# EAGLE design projekt (EAGLE 7.6.0)
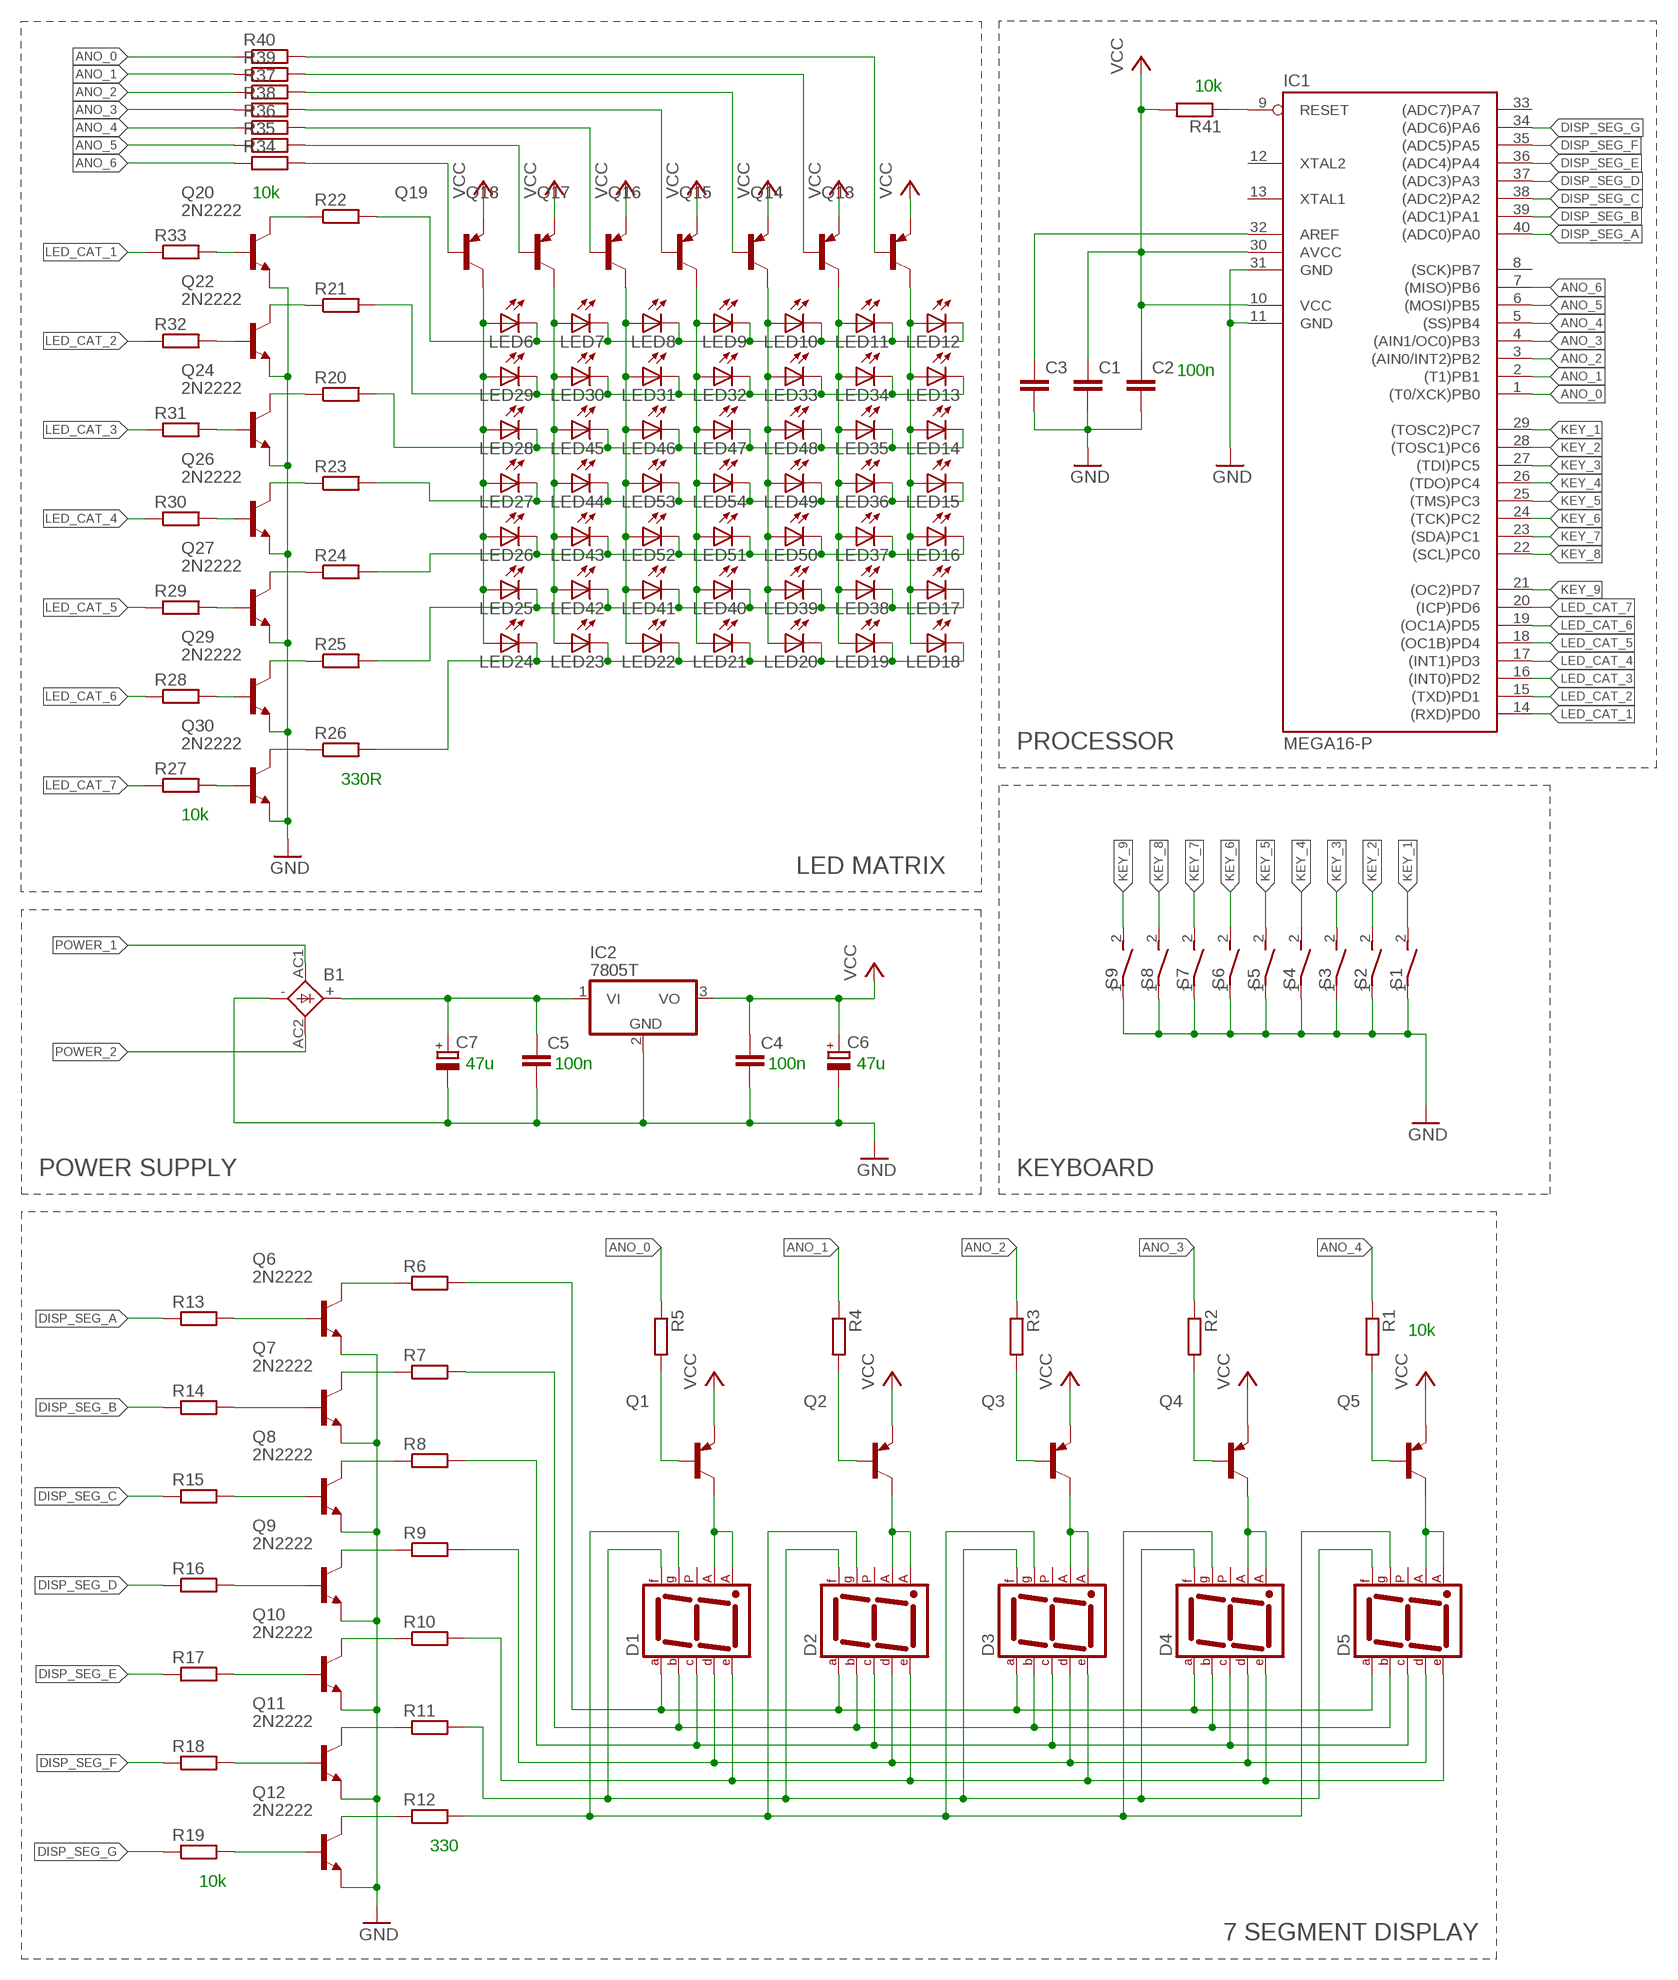
[diagram p0: schematic, sheet 1]

## Parts
B1  KBU  [KBU]
C1  C5/7.2  [C5B7.2]
C2  C5/7.2  [C5B7.2]
C3  C5/7.2  [C5B7.2]
C4  C5/7.2  [C5B7.2]
C5  C5/7.2  [C5B7.2]
C6  CPOL-EUB45181C  [B45181C]
C7  CPOL-EUB45181C  [B45181C]
D1  7SEG-CA  [7SEG-13]
D2  7SEG-CA  [7SEG-13]
D3  7SEG-CA  [7SEG-13]
D4  7SEG-CA  [7SEG-13]
D5  7SEG-CA  [7SEG-13]
IC1  MEGA16-P  [DIL40]
IC2  7805T  [TO220H]
LED6  LED3MM  [LED3MM]
LED7  LED3MM  [LED3MM]
LED8  LED3MM  [LED3MM]
LED9  LED3MM  [LED3MM]
LED10  LED3MM  [LED3MM]
LED11  LED3MM  [LED3MM]
LED12  LED3MM  [LED3MM]
LED13  LED3MM  [LED3MM]
LED14  LED3MM  [LED3MM]
LED15  LED3MM  [LED3MM]
LED16  LED3MM  [LED3MM]
LED17  LED3MM  [LED3MM]
LED18  LED3MM  [LED3MM]
LED19  LED3MM  [LED3MM]
LED20  LED3MM  [LED3MM]
LED21  LED3MM  [LED3MM]
LED22  LED3MM  [LED3MM]
LED23  LED3MM  [LED3MM]
LED24  LED3MM  [LED3MM]
LED25  LED3MM  [LED3MM]
LED26  LED3MM  [LED3MM]
LED27  LED3MM  [LED3MM]
LED28  LED3MM  [LED3MM]
LED29  LED3MM  [LED3MM]
LED30  LED3MM  [LED3MM]
LED31  LED3MM  [LED3MM]
LED32  LED3MM  [LED3MM]
LED33  LED3MM  [LED3MM]
LED34  LED3MM  [LED3MM]
LED35  LED3MM  [LED3MM]
LED36  LED3MM  [LED3MM]
LED37  LED3MM  [LED3MM]
LED38  LED3MM  [LED3MM]
LED39  LED3MM  [LED3MM]
LED40  LED3MM  [LED3MM]
LED41  LED3MM  [LED3MM]
LED42  LED3MM  [LED3MM]
LED43  LED3MM  [LED3MM]
LED44  LED3MM  [LED3MM]
LED45  LED3MM  [LED3MM]
LED46  LED3MM  [LED3MM]
LED47  LED3MM  [LED3MM]
LED48  LED3MM  [LED3MM]
LED49  LED3MM  [LED3MM]
LED50  LED3MM  [LED3MM]
LED51  LED3MM  [LED3MM]
LED52  LED3MM  [LED3MM]
LED53  LED3MM  [LED3MM]
LED54  LED3MM  [LED3MM]
Q1  -PNP-TO18-  [TO18-]
Q2  -PNP-TO18-  [TO18-]
Q3  -PNP-TO18-  [TO18-]
Q4  -PNP-TO18-  [TO18-]
Q5  -PNP-TO18-  [TO18-]
Q6  2N2222  [TO18]
Q7  2N2222  [TO18]
Q8  2N2222  [TO18]
Q9  2N2222  [TO18]
Q10  2N2222  [TO18]
Q11  2N2222  [TO18]
Q12  2N2222  [TO18]
Q13  -PNP-TO18-  [TO18-]
Q14  -PNP-TO18-  [TO18-]
Q15  -PNP-TO18-  [TO18-]
Q16  -PNP-TO18-  [TO18-]
Q17  -PNP-TO18-  [TO18-]
Q18  -PNP-TO18-  [TO18-]
Q19  -PNP-TO18-  [TO18-]
Q20  2N2222  [TO18]
Q22  2N2222  [TO18]
Q24  2N2222  [TO18]
Q26  2N2222  [TO18]
Q27  2N2222  [TO18]
Q29  2N2222  [TO18]
Q30  2N2222  [TO18]
R1  R-EU_0204/5  [0204/5]
R2  R-EU_0204/5  [0204/5]
R3  R-EU_0204/5  [0204/5]
R4  R-EU_0204/5  [0204/5]
R5  R-EU_0204/5  [0204/5]
R6  R-EU_0204/5  [0204/5]
R7  R-EU_0204/5  [0204/5]
R8  R-EU_0204/5  [0204/5]
R9  R-EU_0204/5  [0204/5]
R10  R-EU_0204/5  [0204/5]
R11  R-EU_0204/5  [0204/5]
R12  R-EU_0204/5  [0204/5]
R13  R-EU_0204/5  [0204/5]
R14  R-EU_0204/5  [0204/5]
R15  R-EU_0204/5  [0204/5]
R16  R-EU_0204/5  [0204/5]
R17  R-EU_0204/5  [0204/5]
R18  R-EU_0204/5  [0204/5]
R19  R-EU_0204/5  [0204/5]
R20  R-EU_0204/5  [0204/5]
R21  R-EU_0204/5  [0204/5]
R22  R-EU_0204/5  [0204/5]
R23  R-EU_0204/5  [0204/5]
R24  R-EU_0204/5  [0204/5]
R25  R-EU_0204/5  [0204/5]
R26  R-EU_0204/5  [0204/5]
R27  R-EU_0204/5  [0204/5]
R28  R-EU_0204/5  [0204/5]
R29  R-EU_0204/5  [0204/5]
R30  R-EU_0204/5  [0204/5]
R31  R-EU_0204/5  [0204/5]
R32  R-EU_0204/5  [0204/5]
R33  R-EU_0204/5  [0204/5]
R34  R-EU_0204/5  [0204/5]
R35  R-EU_0204/5  [0204/5]
R36  R-EU_0204/5  [0204/5]
R37  R-EU_0204/5  [0204/5]
R38  R-EU_0204/5  [0204/5]
R39  R-EU_0204/5  [0204/5]
R40  R-EU_0204/5  [0204/5]
R41  R-EU_0204/5  [0204/5]
S1  DS01E  [DS-01]
S2  DS01E  [DS-01]
S3  DS01E  [DS-01]
S4  DS01E  [DS-01]
S5  DS01E  [DS-01]
S6  DS01E  [DS-01]
S7  DS01E  [DS-01]
S8  DS01E  [DS-01]
S9  DS01E  [DS-01]

## Nets
ANO_0: IC1.1((T0/XCK)PB0) R5.1 R40.1
ANO_1: IC1.2((T1)PB1) R4.1 R39.1
ANO_2: IC1.3((AIN0/INT2)PB2) R3.1 R37.1
ANO_3: IC1.4((AIN1/OC0)PB3) R2.1 R38.1
ANO_4: IC1.5((SS)PB4) R1.1 R36.1
ANO_5: IC1.6((MOSI)PB5) R35.1
ANO_6: IC1.7((MISO)PB6) R34.1
DISP_SEG_A: IC1.40((ADC0)PA0) R13.1
DISP_SEG_B: IC1.39((ADC1)PA1) R14.1
DISP_SEG_C: IC1.38((ADC2)PA2) R15.1
DISP_SEG_D: IC1.37((ADC3)PA3) R16.1
DISP_SEG_E: IC1.36((ADC4)PA4) R17.1
DISP_SEG_F: IC1.35((ADC5)PA5) R18.1
DISP_SEG_G: IC1.34((ADC6)PA6) R19.1
GND: B1.- C1.2 C2.2 C3.2 C4.2 C5.2 C6.- C7.- IC1.11(GND) IC1.31(GND) IC2.2(GND) Q6.1(E) Q7.1(E) Q8.1(E) Q9.1(E) Q10.1(E) Q11.1(E) Q12.1(E) Q20.1(E) Q22.1(E) Q24.1(E) Q26.1(E) Q27.1(E) Q29.1(E) Q30.1(E) S1.1 S2.1 S3.1 S4.1 S5.1 S6.1 S7.1 S8.1 S9.1
KEY_1: IC1.29((TOSC2)PC7) S1.2
KEY_2: IC1.28((TOSC1)PC6) S2.2
KEY_3: IC1.27((TDI)PC5) S3.2
KEY_4: IC1.26((TDO)PC4) S4.2
KEY_5: IC1.25((TMS)PC3) S5.2
KEY_6: IC1.24((TCK)PC2) S6.2
KEY_7: IC1.23((SDA)PC1) S7.2
KEY_8: IC1.22((SCL)PC0) S8.2
KEY_9: IC1.21((OC2)PD7) S9.2
LED_CAT_1: IC1.14((RXD)PD0) R33.1
LED_CAT_2: IC1.15((TXD)PD1) R32.1
LED_CAT_3: IC1.16((INT0)PD2) R31.1
LED_CAT_4: IC1.17((INT1)PD3) R30.1
LED_CAT_5: IC1.18((OC1B)PD4) R29.1
LED_CAT_6: IC1.19((OC1A)PD5) R28.1
LED_CAT_7: IC1.20((ICP)PD6) R27.1
N$1: D1.7(A) D2.7(A) D3.7(A) D4.7(A) D5.7(A) R6.2
N$2: D1.6(B) D2.6(B) D3.6(B) D4.6(B) D5.6(B) R7.2
N$3: D1.4(C) D2.4(C) D3.4(C) D4.4(C) D5.4(C) R8.2
N$4: D1.2(D) D2.2(D) D3.2(D) D4.2(D) D5.2(D) R9.2
N$5: D1.1(E) D2.1(E) D3.1(E) D4.1(E) D5.1(E) R10.2
N$6: D1.9(F) D2.9(F) D3.9(F) D4.9(F) D5.9(F) R11.2
N$8: D1.3(CA1) D1.8(CA2) Q1.3(C)
N$9: D2.3(CA1) D2.8(CA2) Q2.3(C)
N$10: D3.3(CA1) D3.8(CA2) Q3.3(C)
N$11: D4.3(CA1) D4.8(CA2) Q4.3(C)
N$12: D5.3(CA1) D5.8(CA2) Q5.3(C)
N$13: Q1.2(B) R5.2
N$14: Q2.2(B) R4.2
N$15: Q3.2(B) R3.2
N$16: Q4.2(B) R2.2
N$17: Q5.2(B) R1.2
N$18: Q6.3(C) R6.1
N$19: Q7.3(C) R7.1
N$20: Q8.3(C) R8.1
N$21: Q9.3(C) R9.1
N$22: Q10.3(C) R10.1
N$23: Q11.3(C) R11.1
N$24: Q12.3(C) R12.1
N$25: D1.10(G) D2.10(G) D3.10(G) D4.10(G) D5.10(G) R12.2
N$26: B1.+ C5.1 C7.+ IC2.1(VI)
N$36: Q8.2(B) R15.2
N$38: Q9.2(B) R16.2
N$39: Q10.2(B) R17.2
N$40: Q11.2(B) R18.2
N$41: Q7.2(B) R14.2
N$42: Q6.2(B) R13.2
N$43: Q12.2(B) R19.2
N$51: LED13.K(C) LED29.K(C) LED30.K(C) LED31.K(C) LED32.K(C) LED33.K(C) LED34.K(C) R21.2
N$52: LED14.K(C) LED28.K(C) LED35.K(C) LED45.K(C) LED46.K(C) LED47.K(C) LED48.K(C) R20.2
N$53: LED15.K(C) LED27.K(C) LED36.K(C) LED44.K(C) LED49.K(C) LED53.K(C) LED54.K(C) R23.2
N$54: LED16.K(C) LED26.K(C) LED37.K(C) LED43.K(C) LED50.K(C) LED51.K(C) LED52.K(C) R24.2
N$55: LED17.K(C) LED25.K(C) LED38.K(C) LED39.K(C) LED40.K(C) LED41.K(C) LED42.K(C) R25.2
N$56: LED18.K(C) LED19.K(C) LED20.K(C) LED21.K(C) LED22.K(C) LED23.K(C) LED24.K(C) R26.2
N$57: LED6.A LED24.A LED25.A LED26.A LED27.A LED28.A LED29.A Q19.3(C)
N$58: LED7.A LED23.A LED30.A LED42.A LED43.A LED44.A LED45.A Q18.3(C)
N$59: LED8.A LED22.A LED31.A LED41.A LED46.A LED52.A LED53.A Q17.3(C)
N$60: LED9.A LED21.A LED32.A LED40.A LED47.A LED51.A LED54.A Q16.3(C)
N$61: LED10.A LED20.A LED33.A LED39.A LED48.A LED49.A LED50.A Q15.3(C)
N$62: LED11.A LED19.A LED34.A LED35.A LED36.A LED37.A LED38.A Q14.3(C)
N$63: LED12.A LED13.A LED14.A LED15.A LED16.A LED17.A LED18.A Q13.3(C)
N$65: Q30.3(C) R26.1
N$66: LED6.K(C) LED7.K(C) LED8.K(C) LED9.K(C) LED10.K(C) LED11.K(C) LED12.K(C) R22.2
N$78: Q13.2(B) R40.2
N$79: Q29.3(C) R25.1
N$80: Q27.3(C) R24.1
N$81: Q26.3(C) R23.1
N$82: Q24.3(C) R20.1
N$83: Q22.3(C) R21.1
N$84: Q20.3(C) R22.1
N$85: Q20.2(B) R33.2
N$86: Q22.2(B) R32.2
N$87: Q26.2(B) R30.2
N$88: Q24.2(B) R31.2
N$89: Q27.2(B) R29.2
N$90: Q29.2(B) R28.2
N$91: Q30.2(B) R27.2
N$92: Q18.2(B) R35.2
N$93: Q17.2(B) R36.2
N$94: Q15.2(B) R37.2
N$95: Q19.2(B) R34.2
N$96: Q16.2(B) R38.2
N$97: Q14.2(B) R39.2
N$99: IC1.9(RESET) R41.1
N$100: C3.1 IC1.32(AREF)
POWER_1: B1.AC1
POWER_2: B1.AC2
VCC: C1.1 C2.1 C4.1 C6.+ IC1.10(VCC) IC1.30(AVCC) IC2.3(VO) Q1.1(E) Q2.1(E) Q3.1(E) Q4.1(E) Q5.1(E) Q13.1(E) Q14.1(E) Q15.1(E) Q16.1(E) Q17.1(E) Q18.1(E) Q19.1(E) R41.2
Unconnected: D1.5(DP) D2.5(DP) D3.5(DP) D4.5(DP) D5.5(DP) IC1.8((SCK)PB7) IC1.12(XTAL2) IC1.13(XTAL1) IC1.33((ADC7)PA7)

## Notes on the sheet
- 10k
- 10k
- 100n
- PROCESSOR
- 330R
- 10k
- LED MATRIX
- 47u | 100n | 100n | 47u
- POWER SUPPLY | KEYBOARD
- 10k
- 330
- 10k
- 7 SEGMENT DISPLAY

## Library data of the parts
B1 = rectifier:KBU: DIOTEC RECTIFIER
C1-C5 = capacitor-wima:C: CAPACITOR naming: grid - package width
C6 C7 = rcl:CPOL-EU: POLARIZED CAPACITOR, European symbol
D1-D5 = special:7SEG-CA: 7-segment DISPLAY single anode, 13 mm
IC1 = atmel:MEGA16-P: MICROCONTROLLER 16 Kbytes FLASH 1 kbytes SRAM 512 bytes EEPROM USART 8-channel 10 bit ADC Source: avr.lbr; MPN: ATMEGA16-16PU; OC_FARNELL: 9171142; OC_NEWARK: 01M6885
IC2 = linear:78*: Positive VOLTAGE REGULATOR Source: http://cache.national.com/ds/LM/LM78L05.pdf http://www.fairchildsemi.com/ds/LM/LM7805.pdf
LED6-LED54 = led:LED: LED OSRAM: - CHIPLED LG R971, LG N971, LY N971, LG Q971, LY Q971, LO R971, LY R971 LH N974, LH R974 LS Q976, LO Q976, LY Q976 LO Q996 - Hyper CHIPLED LW Q18S LB Q993, LB Q99A, LB R99A - SideLED LS A670, LO A670, LY A670, LG A670, LP A670 LB A673, LV A673, LT A673, LW A673 LH A674 LY A675 LS A676, LA A676, LO A676, LY A676, LW A676 LS A679, LY A679, LG A679 - Hyper Micro SIDELED® LS Y876, LA Y876, LO Y876, LY Y876 LT Y87S - SmartLED LW L88C, LW L88S LB L89C, LB L89S, LG L890 LS L89K, LO L89K, LY L89K LS L896, LA L896, LO L896, LY L896 - TOPLED LS T670, LO T670, LY T670, LG T670, LP T670 LSG T670, LSP T670, LSY T670, LOP T670, LYG T670 LG T671, LOG T671, LSG T671 LB T673, LV T673, LT T673, LW T673 LH T674 LS T676, LA T676, LO T676, LY T676, LB T676, LH T676, LSB T676, LW T676 LB T67C, LV T67C, LT T67C, LS T67K, LO T67K, LY T67K, LW E67C LS E67B, LA E67B, LO E67B, LY E67B, LB E67C, LV E67C, LT E67C LW T67C LS T679, LY T679, LG T679 LS T770, LO T770, LY T770, LG T770, LP T770 LB T773, LV T773, LT T773, LW T773 LH T774 LS E675, LA E675, LY E675, LS T675 LS T776, LA T776, LO T776, LY T776, LB T776 LHGB T686 LT T68C, LB T68C - Hyper Mini TOPLED® LB M676 - Mini TOPLED Santana® LG M470 LS M47K, LO M47K, LY M47K Source: http://www.osram.convergy.de LUXEON: - LUMILED® LXK2-PW12-R00, LXK2-PW12-S00, LXK2-PW14-U00, LXK2-PW14-V00 LXK2-PM12-R00, LXK2-PM12-S00, LXK2-PM14-U00 LXK2-PE12-Q00, LXK2-PE12-R00, LXK2-PE12-S00, LXK2-PE14-T00, LXK2-PE14-U00 LXK2-PB12-K00, LXK2-PB12-L00, LXK2-PB12-M00, LXK2-PB14-N00, LXK2-PB14-P00, LXK2-PB14-Q00 LXK2-PR12-L00, LXK2-PR12-M00, LXK2-PR14-Q00, LXK2-PR14-R00 LXK2-PD12-Q00, LXK2-PD12-R00, LXK2-PD12-S00 LXK2-PH12-R00, LXK2-PH12-S00 LXK2-PL12-P00, LXK2-PL12-Q00, LXK2-PL12-R00 Source: www.luxeon.com KINGBRIGHT: KA-3528ASYC Source: www.kingbright.com
Q1-Q5 Q13-Q19 = transistor:*-PNP-: PNP Transistror
Q6-Q12 Q20 Q22 Q24 Q26 Q27 Q29 Q30 = transistor-npn:2N2222*: NPN Transistor
R1-R41 = resistor:R-EU_: RESISTOR, European symbol
S1-S9 = switch-dil:DS01E: DIL/CODE SWITCH; OC_FARNELL: unknown; OC_NEWARK: unknown

## Board
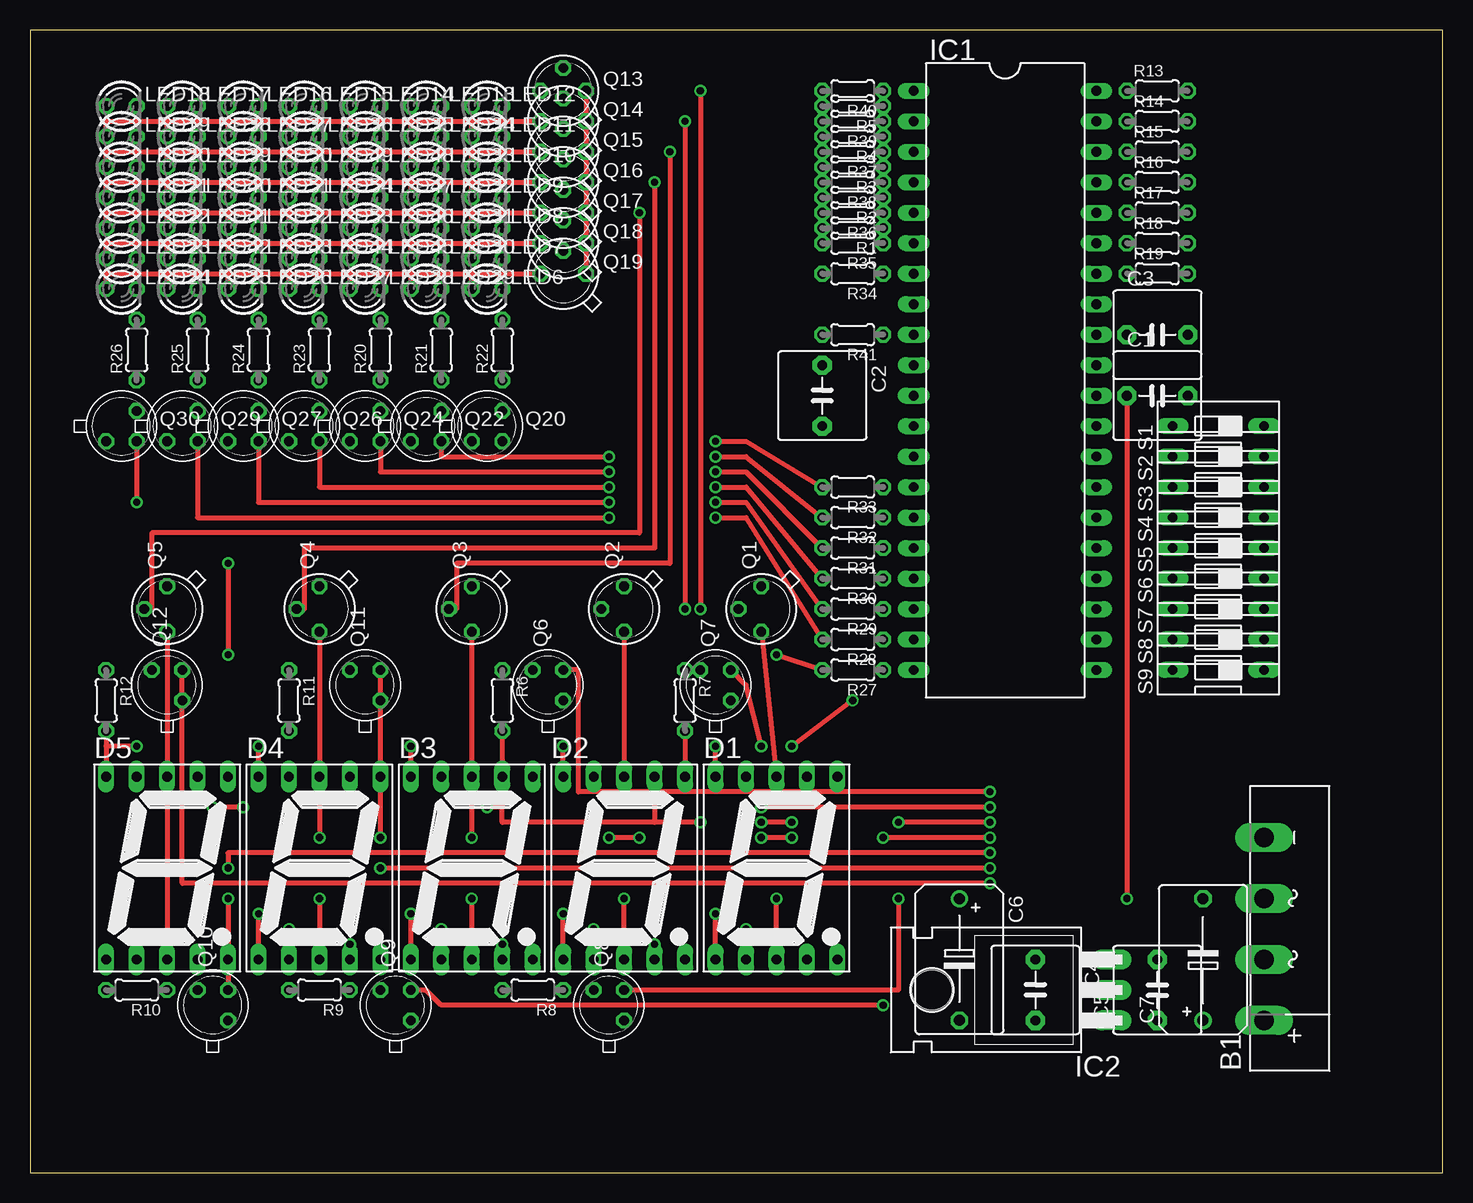
[diagram p1: board, top side]
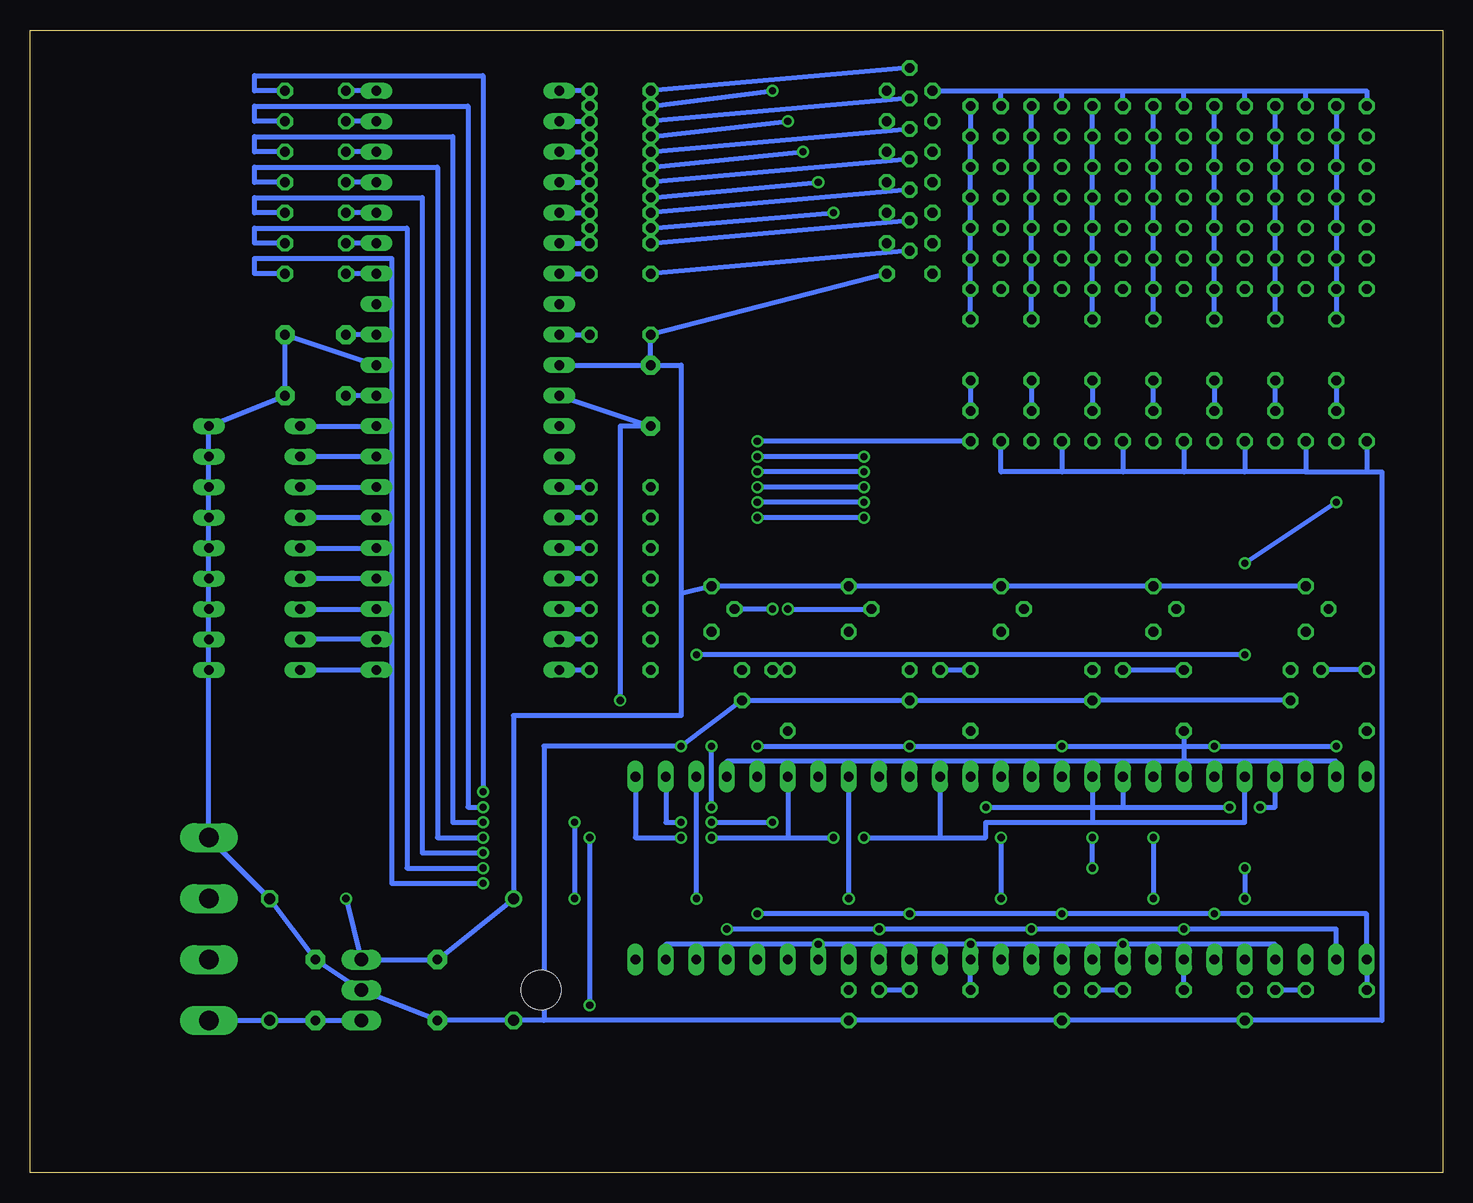
[diagram p2: board, bottom side, seen from below]

Size 117.78 x 95.24 mm. Coordinates in mm from the lower left corner, seen from the top.
Outline: 0,0 117.78,0 117.78,95.24 0,95.24 0,0
Copper layers (1*16): Top 0.035mm / dielectric 1.5mm / Bottom 0.035mm
Design rules "default": minimum track width 10mil, minimum drill 24mil, track to track 8mil, track to pad 8mil, pad to pad 8mil, via to via 8mil, smd to smd 8mil, copper to edge 40mil, drill to drill 8mil, minimum pad ring 10mil, minimum via ring 8mil, stop-mask expansion 4mil, vias tented up to drill 0mil, thermal gap 10mil

### Footprints (pad centres in the part's own frame; a part is rotated, then mirrored left to right if it is on the bottom)
KBU = drill 1.6 long: + -7.62,2.54; - 7.62,2.54; AC1 -2.54,2.54; AC2 2.54,2.54
C5B7.2 = drill 0.813 pad 1.6 octagon: 1 -2.54,0; 2 2.54,0
B45181C = drill 0.914: + -5.08,0 | drill 0.914 octagon: - 5.08,0
7SEG-13 = drill 0.813 long: 1 -5.08,-7.62; 2 -2.54,-7.62; 3 0,-7.62; 4 2.54,-7.62; 5 5.08,-7.62; 6 5.08,7.62; 7 2.54,7.62; 8 0,7.62; 9 -2.54,7.62; 10 -5.08,7.62
DIL40 = drill 0.813 long: 1 -24.13,-7.62; 2 -21.59,-7.62; 3 -19.05,-7.62; 4 -16.51,-7.62; 5 -13.97,-7.62; 6 -11.43,-7.62; 7 -8.89,-7.62; 8 -6.35,-7.62; 9 -3.81,-7.62; 10 -1.27,-7.62; 11 1.27,-7.62; 12 3.81,-7.62; 13 6.35,-7.62; 14 8.89,-7.62; 15 11.43,-7.62; 16 13.97,-7.62; 17 16.51,-7.62; 18 19.05,-7.62; 19 21.59,-7.62; 20 24.13,-7.62; 21 24.13,7.62; 22 21.59,7.62; 23 19.05,7.62; 24 16.51,7.62; 25 13.97,7.62; 26 11.43,7.62; 27 8.89,7.62; 28 6.35,7.62; 29 3.81,7.62; 30 1.27,7.62; 31 -1.27,7.62; 32 -3.81,7.62; 33 -6.35,7.62; 34 -8.89,7.62; 35 -11.43,7.62; 36 -13.97,7.62; 37 -16.51,7.62; 38 -19.05,7.62; 39 -21.59,7.62; 40 -24.13,7.62
TO220H = drill 1.118 long: 1 -2.54,-10.16; 2 0,-10.16; 3 2.54,-10.16 | hole 3.302: 0,4.826
LED3MM = drill 0.813 octagon: A -1.27,0; K 1.27,0
TO18- = drill 0.813 octagon: 1 1.905,0; 2 0,1.905; 3 -1.905,0
TO18 = drill 0.813 octagon: 1 -1.27,-1.27; 2 1.27,-1.27; 3 1.27,1.27
0204/5 = drill 0.813 octagon: 1 -2.54,0; 2 2.54,0
DS-01 = drill 0.813 long: 1 0,-3.81; 2 0,3.81

### Placement (x,y rotation side)
B1  105.41,20.32 90 top
C1  93.98,64.77 0 top
C2  66.04,64.77 270 top
C3  93.98,69.85 0 top
C4  83.82,15.24 270 top
C5  93.98,15.24 90 top
C6  77.47,17.78 270 top
C7  97.79,17.78 90 top
D1  62.23,25.4 0 top
D2  49.53,25.4 0 top
D3  36.83,25.4 0 top
D4  24.13,25.4 0 top
D5  11.43,25.4 0 top
IC1  81.28,66.04 270 top
IC2  80.01,15.24 90 top
LED6  38.1,73.66 0 top
LED7  38.1,76.2 0 top
LED8  38.1,78.74 0 top
LED9  38.1,81.28 0 top
LED10  38.1,83.82 0 top
LED11  38.1,86.36 0 top
LED12  38.1,88.9 0 top
LED13  33.02,88.9 0 top
LED14  27.94,88.9 0 top
LED15  22.86,88.9 0 top
LED16  17.78,88.9 0 top
LED17  12.7,88.9 0 top
LED18  7.62,88.9 0 top
LED19  7.62,86.36 0 top
LED20  7.62,83.82 0 top
LED21  7.62,81.28 0 top
LED22  7.62,78.74 0 top
LED23  7.62,76.2 0 top
LED24  7.62,73.66 0 top
LED25  12.7,73.66 0 top
LED26  17.78,73.66 0 top
LED27  22.86,73.66 0 top
LED28  27.94,73.66 0 top
LED29  33.02,73.66 0 top
LED30  33.02,76.2 0 top
LED31  33.02,78.74 0 top
LED32  33.02,81.28 0 top
LED33  33.02,83.82 0 top
LED34  33.02,86.36 0 top
LED35  27.94,86.36 0 top
LED36  22.86,86.36 0 top
LED37  17.78,86.36 0 top
LED38  12.7,86.36 0 top
LED39  12.7,83.82 0 top
LED40  12.7,81.28 0 top
LED41  12.7,78.74 0 top
LED42  12.7,76.2 0 top
LED43  17.78,76.2 0 top
LED44  22.86,76.2 0 top
LED45  27.94,76.2 0 top
LED46  27.94,78.74 0 top
LED47  27.94,81.28 0 top
LED48  27.94,83.82 0 top
LED49  22.86,83.82 0 top
LED50  17.78,83.82 0 top
LED51  17.78,81.28 0 top
LED52  17.78,78.74 0 top
LED53  22.86,78.74 0 top
LED54  22.86,81.28 0 top
Q1  60.96,46.99 90 top
Q2  49.53,46.99 90 top
Q3  36.83,46.99 90 top
Q4  24.13,46.99 90 top
Q5  11.43,46.99 90 top
Q6  43.18,40.64 90 top
Q7  57.15,40.64 90 top
Q8  48.26,13.97 90 top
Q9  30.48,13.97 90 top
Q10  15.24,13.97 90 top
Q11  27.94,40.64 90 top
Q12  11.43,40.64 90 top
Q13  44.45,90.17 0 top
Q14  44.45,87.63 0 top
Q15  44.45,85.09 0 top
Q16  44.45,82.55 0 top
Q17  44.45,80.01 0 top
Q18  44.45,77.47 0 top
Q19  44.45,74.93 0 top
Q20  38.1,62.23 0 top
Q22  33.02,62.23 0 top
Q24  27.94,62.23 0 top
Q26  22.86,62.23 0 top
Q27  17.78,62.23 0 top
Q29  12.7,62.23 0 top
Q30  7.62,62.23 0 top
R1  68.58,78.74 180 top
R2  68.58,81.28 180 top
R3  68.58,83.82 180 top
R4  68.58,86.36 180 top
R5  68.58,88.9 180 top
R6  39.37,39.37 270 top
R7  54.61,39.37 270 top
R8  41.91,15.24 180 top
R9  24.13,15.24 180 top
R10  8.89,15.24 180 top
R11  21.59,39.37 270 top
R12  6.35,39.37 270 top
R13  93.98,90.17 0 top
R14  93.98,87.63 0 top
R15  93.98,85.09 0 top
R16  93.98,82.55 0 top
R17  93.98,80.01 0 top
R18  93.98,77.47 0 top
R19  93.98,74.93 0 top
R20  29.21,68.58 90 top
R21  34.29,68.58 90 top
R22  39.37,68.58 90 top
R23  24.13,68.58 90 top
R24  19.05,68.58 90 top
R25  13.97,68.58 90 top
R26  8.89,68.58 90 top
R27  68.58,41.91 180 top
R28  68.58,44.45 180 top
R29  68.58,46.99 180 top
R30  68.58,49.53 180 top
R31  68.58,52.07 180 top
R32  68.58,54.61 180 top
R33  68.58,57.15 180 top
R34  68.58,74.93 180 top
R35  68.58,77.47 180 top
R36  68.58,80.01 180 top
R37  68.58,85.09 180 top
R38  68.58,82.55 180 top
R39  68.58,87.63 180 top
R40  68.58,90.17 180 top
R41  68.58,69.85 180 top
S1  99.06,62.23 90 top
S2  99.06,59.69 90 top
S3  99.06,57.15 90 top
S4  99.06,54.61 90 top
S5  99.06,52.07 90 top
S6  99.06,49.53 90 top
S7  99.06,46.99 90 top
S8  99.06,44.45 90 top
S9  99.06,41.91 90 top

### Tracks (layer width: path | path; a pad name or v marks a point on that pad's centre or on a via)
ANO_0
  Bottom 0.406: IC1.1 R40.1 R5.1
ANO_1
  Bottom 0.406: IC1.2 R39.1 R4.1
ANO_2
  Bottom 0.406: IC1.3 R37.1 R3.1
ANO_3
  Bottom 0.406: IC1.4 R38.1 R2.1
ANO_4
  Bottom 0.406: IC1.5 R36.1 R1.1
ANO_5
  Bottom 0.406: IC1.6 R35.1
ANO_6
  Bottom 0.406: IC1.7 R34.1
DISP_SEG_A
  Bottom 0.406: IC1.40 R13.1
DISP_SEG_B
  Bottom 0.406: IC1.39 R14.1
DISP_SEG_C
  Bottom 0.406: IC1.38 R15.1
DISP_SEG_D
  Bottom 0.406: IC1.37 R16.1
DISP_SEG_E
  Bottom 0.406: IC1.36 R17.1
DISP_SEG_F
  Bottom 0.406: IC1.35 R18.1
DISP_SEG_G
  Bottom 0.406: IC1.34 R19.1
GND  (via drill 0.6)
  Top 0.406: v68.58,39.37 v63.5,35.56
  Bottom 0.406: 74.93,12.7 Q8.1 Q9.1 Q10.1 5.08,12.7 5.08,58.42 6.35,58.42 | 74.93,12.7 C6.- C4.2 IC2.2 C5.2 C7.- B1.- S9.1 S8.1 S7.1 S6.1 S5.1 S4.1 S3.1 S2.1 S1.1 C1.2 C3.2 IC1.31 | Q12.1 Q11.1 Q6.1 Q7.1 v63.5,35.56 74.93,35.56 74.93,12.7 | IC1.11 C2.2 68.58,62.23 v68.58,39.37 | Q30.1 6.35,58.42 | 11.43,58.42 16.51,58.42 | 16.51,58.42 21.59,58.42 | 21.59,58.42 26.67,58.42 | 26.67,58.42 31.75,58.42 | 31.75,58.42 36.83,58.42 Q20.1 | Q22.1 31.75,58.42 | Q24.1 26.67,58.42 | Q26.1 21.59,58.42 | Q27.1 16.51,58.42 | Q29.1 11.43,58.42 | 11.43,58.42 6.35,58.42
KEY_1
  Bottom 0.406: S1.2 IC1.29
KEY_2
  Bottom 0.406: IC1.28 S2.2
KEY_3
  Bottom 0.406: S3.2 IC1.27
KEY_4
  Bottom 0.406: IC1.26 S4.2
KEY_5
  Bottom 0.406: S5.2 IC1.25
KEY_6
  Bottom 0.406: IC1.24 S6.2
KEY_7
  Bottom 0.406: S7.2 IC1.23
KEY_8
  Bottom 0.406: IC1.22 S8.2
KEY_9
  Bottom 0.406: S9.2 IC1.21
LED_CAT_1
  Bottom 0.406: IC1.14 R33.1
LED_CAT_2
  Bottom 0.406: R32.1 IC1.15
LED_CAT_3
  Bottom 0.406: IC1.16 R31.1
LED_CAT_4
  Bottom 0.406: R30.1 IC1.17
LED_CAT_5
  Bottom 0.406: IC1.18 R29.1
LED_CAT_6
  Bottom 0.406: R28.1 IC1.19
LED_CAT_7
  Bottom 0.406: IC1.20 R27.1
N$1  (via drill 0.6)
  Top 0.406: R6.2 D3.7 39.37,30.48 | v63.5,29.21 v60.96,29.21 | v55.88,29.21 52.07,29.21 | 52.07,29.21 39.37,29.21 39.37,30.48 | 39.37,30.48 v38.1,30.48 | v17.78,30.48 v15.24,30.48 | D2.7 52.07,29.21
  Bottom 0.406: D1.7 64.77,29.21 v63.5,29.21 | v60.96,29.21 v55.88,29.21 | v38.1,30.48 26.67,30.48 | 26.67,30.48 v17.78,30.48 | v15.24,30.48 13.97,30.48 D5.7 | D4.7 26.67,30.48
N$2  (via drill 0.6)
  Top 0.406: R7.2 D2.6 | v63.5,27.94 v60.96,27.94 | v50.8,27.94 v48.26,27.94
  Bottom 0.406: D1.6 67.31,27.94 v63.5,27.94 | v60.96,27.94 54.61,27.94 | 54.61,27.94 v50.8,27.94 | v48.26,27.94 41.91,27.94 | 41.91,27.94 38.1,27.94 38.1,29.21 29.21,29.21 | 29.21,29.21 16.51,29.21 D5.6 | D4.6 29.21,29.21 | D3.6 41.91,27.94 | D2.6 54.61,27.94
N$3  (via drill 0.6)
  Top 0.406: D4.4 v26.67,19.05 | D3.4 v39.37,19.05 | D2.4 v52.07,19.05
  Bottom 0.406: R8.2 D3.4 | D5.4 13.97,19.05 v26.67,19.05 v39.37,19.05 v52.07,19.05 64.77,19.05 D1.4
N$4  (via drill 0.6)
  Top 0.406: v59.69,20.32 D1.2 | D2.2 v46.99,20.32 | D3.2 v34.29,20.32 | D4.2 v21.59,20.32
  Bottom 0.406: R9.2 D4.2 | D5.2 8.89,20.32 v21.59,20.32 v34.29,20.32 v46.99,20.32 v59.69,20.32
N$5  (via drill 0.6)
  Top 0.406: D4.1 v19.05,21.59 | D3.1 v31.75,21.59 | D2.1 v44.45,21.59 | D1.1 v57.15,21.59
  Bottom 0.406: R10.2 D5.1 6.35,21.59 v19.05,21.59 v31.75,21.59 v44.45,21.59 v57.15,21.59
N$6
  Bottom 0.406: D5.9 8.89,34.29 21.59,34.29 | 21.59,34.29 34.29,34.29 | 34.29,34.29 46.99,34.29 | 46.99,34.29 59.69,34.29 D1.9 | D2.9 46.99,34.29 | D3.9 34.29,34.29 | D4.9 21.59,34.29 | R11.2 21.59,34.29
N$8  (via drill 0.6)
  Top 0.406: Q1.3 D1.8 | D1.3 v62.23,22.86
  Bottom 0.406: v62.23,22.86 D1.8
N$9  (via drill 0.6)
  Top 0.406: Q2.3 D2.8 | D2.3 v49.53,22.86
  Bottom 0.406: v49.53,22.86 D2.8
N$10  (via drill 0.6)
  Top 0.406: Q3.3 D3.8 v36.83,27.94 | v36.83,22.86 D3.3
  Bottom 0.406: v36.83,27.94 v36.83,22.86
N$11  (via drill 0.6)
  Top 0.406: Q4.3 D4.8 v24.13,27.94 | v24.13,22.86 D4.3
  Bottom 0.406: v24.13,27.94 v24.13,22.86
N$12
  Top 0.406: Q5.3 D5.8 D5.3
N$13  (via drill 0.6)
  Top 0.406: v55.88,90.17 v55.88,46.99
  Bottom 0.406: R5.2 v55.88,90.17 | v55.88,46.99 Q1.2
N$14  (via drill 0.6)
  Top 0.406: v54.61,87.63 v54.61,46.99
  Bottom 0.406: R4.2 v54.61,87.63 | v54.61,46.99 Q2.2
N$15  (via drill 0.6)
  Top 0.406: v53.34,85.09 53.34,50.8 35.56,50.8 35.56,46.99 Q3.2
  Bottom 0.406: R3.2 v53.34,85.09
N$16  (via drill 0.6)
  Top 0.406: v52.07,82.55 52.07,52.07 22.86,52.07 22.86,46.99 Q4.2
  Bottom 0.406: R2.2 v52.07,82.55
N$17  (via drill 0.6)
  Top 0.406: v50.8,80.01 50.8,53.34 10.16,53.34 10.16,46.99 Q5.2
  Bottom 0.406: R1.2 v50.8,80.01
N$18
  Bottom 0.406: Q6.3 R6.1
N$19
  Bottom 0.406: Q7.3 R7.1
N$20
  Bottom 0.406: R8.1 Q8.3
N$21
  Bottom 0.406: R9.1 Q9.3
N$22
  Bottom 0.406: R10.1 Q10.3
N$23
  Bottom 0.406: Q11.3 R11.1
N$24
  Bottom 0.406: R12.1 Q12.3
N$25  (via drill 0.6)
  Top 0.406: R12.2 6.35,35.56 | 6.35,35.56 D5.10 | D1.10 v57.15,35.56 | v8.89,35.56 6.35,35.56 | D2.10 v44.45,35.56 | D3.10 v31.75,35.56 | D4.10 v19.05,35.56
  Bottom 0.406: v57.15,35.56 v44.45,35.56 v31.75,35.56 v19.05,35.56 v8.89,35.56
N$26
  Bottom 0.406: B1.+ C7.+ C5.1 IC2.1
N$36  (via drill 0.6)
  Top 0.406: v80.01,29.21 v72.39,29.21 | v72.39,22.86 72.39,15.24 Q8.2
  Bottom 0.406: R15.2 99.06,85.09 99.06,86.36 82.55,86.36 82.55,29.21 v80.01,29.21 | v72.39,29.21 v72.39,22.86
N$38  (via drill 0.6)
  Top 0.406: v80.01,27.94 v71.12,27.94 | v71.12,13.97 34.29,13.97 33.02,15.24 Q9.2
  Bottom 0.406: R16.2 99.06,82.55 99.06,83.82 83.82,83.82 83.82,27.94 v80.01,27.94 | v71.12,27.94 v71.12,13.97
N$39  (via drill 0.6)
  Top 0.406: v80.01,26.67 16.51,26.67 v16.51,25.4 | v16.51,22.86 Q10.2
  Bottom 0.406: R17.2 99.06,80.01 99.06,81.28 85.09,81.28 85.09,26.67 v80.01,26.67 | v16.51,25.4 v16.51,22.86
N$40  (via drill 0.6)
  Top 0.406: v80.01,25.4 v29.21,25.4 | v29.21,27.94 Q11.2
  Bottom 0.406: R18.2 99.06,77.47 99.06,78.74 86.36,78.74 86.36,25.4 v80.01,25.4 | v29.21,25.4 v29.21,27.94
N$41  (via drill 0.6)
  Top 0.406: v80.01,30.48 v60.96,30.48 | v60.96,35.56 59.69,40.64 Q7.2
  Bottom 0.406: R14.2 99.06,87.63 99.06,88.9 81.28,88.9 81.28,30.48 v80.01,30.48 | v60.96,30.48 v60.96,35.56
N$42  (via drill 0.6)
  Top 0.406: v80.01,31.75 45.72,31.75 45.72,41.91 Q6.2
  Bottom 0.406: R13.2 99.06,90.17 99.06,91.44 80.01,91.44 v80.01,31.75
N$43  (via drill 0.6)
  Top 0.406: v80.01,24.13 12.7,24.13 Q12.2
  Bottom 0.406: R19.2 99.06,74.93 99.06,76.2 87.63,76.2 87.63,24.13 v80.01,24.13
N$51
  Bottom 0.406: R21.2 LED29.K LED30.K LED31.K LED32.K LED33.K LED34.K LED13.K
N$52
  Bottom 0.406: R20.2 LED28.K LED45.K LED46.K LED47.K LED48.K LED35.K LED14.K
N$53
  Bottom 0.406: R23.2 LED27.K LED44.K LED53.K LED54.K LED49.K LED36.K LED15.K
N$54
  Bottom 0.406: R24.2 LED26.K LED43.K LED52.K LED51.K LED50.K LED37.K LED16.K
N$55
  Bottom 0.406: R25.2 LED25.K LED42.K LED41.K LED40.K LED39.K LED38.K LED17.K
N$56
  Bottom 0.406: LED18.K LED19.K LED20.K LED21.K LED22.K LED23.K LED24.K R26.2
N$57
  Top 0.406: LED24.A 6.35,74.93 11.43,74.93 | 11.43,74.93 16.51,74.93 | 16.51,74.93 21.59,74.93 | 21.59,74.93 26.67,74.93 | 26.67,74.93 31.75,74.93 | 31.75,74.93 36.83,74.93 | 36.83,74.93 Q19.3 | LED6.A 36.83,74.93 | LED29.A 31.75,74.93 | LED28.A 26.67,74.93 | LED27.A 21.59,74.93 | LED26.A 16.51,74.93 | LED25.A 11.43,74.93
N$58
  Top 0.406: LED23.A 6.35,77.47 11.43,77.47 | 11.43,77.47 16.51,77.47 | 16.51,77.47 21.59,77.47 | 21.59,77.47 26.67,77.47 | 26.67,77.47 31.75,77.47 | 31.75,77.47 36.83,77.47 | 36.83,77.47 Q18.3 | LED7.A 36.83,77.47 | LED30.A 31.75,77.47 | LED45.A 26.67,77.47 | LED44.A 21.59,77.47 | LED43.A 16.51,77.47 | LED42.A 11.43,77.47
N$59
  Top 0.406: LED22.A 6.35,80.01 11.43,80.01 | 11.43,80.01 16.51,80.01 | 16.51,80.01 21.59,80.01 | 21.59,80.01 26.67,80.01 | 26.67,80.01 31.75,80.01 | 31.75,80.01 36.83,80.01 | 36.83,80.01 Q17.3 | LED8.A 36.83,80.01 | LED31.A 31.75,80.01 | LED46.A 26.67,80.01 | LED53.A 21.59,80.01 | LED52.A 16.51,80.01 | LED41.A 11.43,80.01
N$60
  Top 0.406: LED21.A 6.35,82.55 11.43,82.55 | 11.43,82.55 16.51,82.55 | 16.51,82.55 21.59,82.55 | 21.59,82.55 26.67,82.55 | 26.67,82.55 31.75,82.55 | 31.75,82.55 36.83,82.55 | 36.83,82.55 Q16.3 | LED9.A 36.83,82.55 | LED32.A 31.75,82.55 | LED47.A 26.67,82.55 | LED54.A 21.59,82.55 | LED51.A 16.51,82.55 | LED40.A 11.43,82.55
N$61
  Top 0.406: LED20.A 6.35,85.09 11.43,85.09 | 11.43,85.09 16.51,85.09 | 16.51,85.09 21.59,85.09 | 21.59,85.09 26.67,85.09 | 26.67,85.09 31.75,85.09 | 31.75,85.09 36.83,85.09 | 36.83,85.09 Q15.3 | LED10.A 36.83,85.09 | LED33.A 31.75,85.09 | LED48.A 26.67,85.09 | LED49.A 21.59,85.09 | LED50.A 16.51,85.09 | LED39.A 11.43,85.09
N$62
  Top 0.406: LED19.A 6.35,87.63 11.43,87.63 | 11.43,87.63 16.51,87.63 | 16.51,87.63 21.59,87.63 | 21.59,87.63 26.67,87.63 | 26.67,87.63 31.75,87.63 | 31.75,87.63 36.83,87.63 | 36.83,87.63 Q14.3 | LED11.A 36.83,87.63 | LED34.A 31.75,87.63 | LED35.A 26.67,87.63 | LED36.A 21.59,87.63 | LED37.A 16.51,87.63 | LED38.A 11.43,87.63
N$63
  Bottom 0.406: Q13.3 36.83,90.17 | 36.83,90.17 31.75,90.17 | 31.75,90.17 26.67,90.17 | 26.67,90.17 21.59,90.17 | 21.59,90.17 16.51,90.17 | 16.51,90.17 11.43,90.17 | 11.43,90.17 6.35,90.17 LED18.A | LED17.A 11.43,90.17 | LED16.A 16.51,90.17 | LED15.A 21.59,90.17 | LED14.A 26.67,90.17 | LED13.A 31.75,90.17 | LED12.A 36.83,90.17
N$65
  Bottom 0.406: R26.1 Q30.3
N$66
  Bottom 0.406: R22.2 LED6.K LED7.K LED8.K LED9.K LED10.K LED11.K LED12.K
N$78
  Bottom 0.406: Q13.2 R40.2
N$79
  Bottom 0.406: Q29.3 R25.1
N$80
  Bottom 0.406: R24.1 Q27.3
N$81
  Bottom 0.406: Q26.3 R23.1
N$82
  Bottom 0.406: R20.1 Q24.3
N$83
  Bottom 0.406: R21.1 Q22.3
N$84
  Bottom 0.406: R22.1 Q20.3
N$85  (via drill 0.6)
  Top 0.406: v57.15,60.96 59.69,60.96 R33.2
  Bottom 0.406: Q20.2 v57.15,60.96
N$86  (via drill 0.6)
  Top 0.406: Q22.2 34.29,59.69 v48.26,59.69 | v57.15,59.69 59.69,59.69 R32.2
  Bottom 0.406: v48.26,59.69 v57.15,59.69
N$87  (via drill 0.6)
  Top 0.406: Q26.2 24.13,57.15 v48.26,57.15 | v57.15,57.15 59.69,57.15 R30.2
  Bottom 0.406: v48.26,57.15 v57.15,57.15
N$88  (via drill 0.6)
  Top 0.406: Q24.2 29.21,58.42 v48.26,58.42 | v57.15,58.42 58.42,58.42 59.69,58.42 R31.2
  Bottom 0.406: v48.26,58.42 v57.15,58.42
N$89  (via drill 0.6)
  Top 0.406: Q27.2 19.05,55.88 v48.26,55.88 | v57.15,55.88 59.69,55.88 R29.2
  Bottom 0.406: v48.26,55.88 v57.15,55.88
N$90  (via drill 0.6)
  Top 0.406: Q29.2 13.97,54.61 v48.26,54.61 | v57.15,54.61 59.69,54.61 R28.2
  Bottom 0.406: v48.26,54.61 v57.15,54.61
N$91  (via drill 0.6)
  Top 0.406: Q30.2 v8.89,55.88 | v16.51,50.8 v16.51,43.18 | v62.23,43.18 R27.2
  Bottom 0.406: v8.89,55.88 v16.51,50.8 | v16.51,43.18 v62.23,43.18
N$92
  Bottom 0.406: R35.2 Q18.2
N$93
  Bottom 0.406: Q17.2 R36.2
N$94
  Bottom 0.406: R37.2 Q15.2
N$95
  Bottom 0.406: Q19.2 R34.2
N$96
  Bottom 0.406: Q16.2 R38.2
N$97
  Bottom 0.406: Q14.2 R39.2
N$99
  Bottom 0.406: IC1.9 R41.1
N$100
  Bottom 0.406: IC1.32 C3.1
VCC  (via drill 0.6)
  Top 0.406: Q13.1 Q14.1 Q15.1 Q16.1 Q17.1 Q18.1 Q19.1 | C1.1 v91.44,22.86
  Bottom 0.406: IC1.10 C2.1 | C2.1 R41.2 Q19.1 | Q5.1 Q4.1 Q3.1 Q2.1 Q1.1 63.5,48.26 | v91.44,22.86 IC2.3 C4.1 C6.+ 77.47,38.1 63.5,38.1 63.5,48.26 | IC1.30 C1.1 | C2.1 63.5,67.31 63.5,48.26